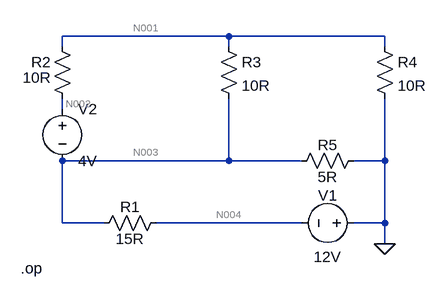
[diagram p0: schematic KSA_5.asc]
KSA_5.asc, the LTspice schematic file:
Version 4
SHEET 1 880 680
WIRE 288 -32 32 -32
WIRE 528 -32 288 -32
WIRE 32 -16 32 -32
WIRE 288 -16 288 -32
WIRE 528 -16 528 -32
WIRE 32 80 32 64
WIRE 288 160 288 64
WIRE 288 160 32 160
WIRE 400 160 288 160
WIRE 528 160 528 64
WIRE 528 160 480 160
WIRE 32 256 32 160
WIRE 96 256 32 256
WIRE 400 256 176 256
WIRE 528 256 528 160
WIRE 528 256 480 256
WIRE 528 288 528 256
FLAG 528 288 0
SYMBOL res 192 240 R90
WINDOW 0 7 56 VBottom 2
WINDOW 3 25 56 VTop 2
SYMATTR InstName R1
SYMATTR Value 15R
SYMBOL res 48 80 R180
WINDOW 0 33 72 Left 2
WINDOW 3 33 48 Left 2
SYMATTR InstName R2
SYMATTR Value 10R
SYMBOL res 272 -32 R0
SYMATTR InstName R3
SYMATTR Value 10R
SYMBOL res 512 -32 R0
SYMATTR InstName R4
SYMATTR Value 10R
SYMBOL res 384 176 R270
WINDOW 0 25 56 VTop 2
WINDOW 3 7 56 VBottom 2
SYMATTR InstName R5
SYMATTR Value 5R
SYMBOL voltage 496 256 R90
WINDOW 0 -27 56 VBottom 2
WINDOW 3 36 56 VTop 2
SYMATTR InstName V1
SYMATTR Value 12V
SYMBOL voltage 32 64 R0
SYMATTR InstName V2
SYMATTR Value 4V
TEXT -32 326 Left 2 !.op

The netlist it stands for:
* KSA_5.asc
R1 N004 N003 15R
R2 N002 N001 10R
R3 N001 N003 10R
R4 N001 0 10R
R5 N003 0 5R
V1 0 N004 12V
V2 N002 N003 4V
.op
.backanno
.end

* Results of the author's LTspice run, read from the files saved beside the schematic
* Operating Point:
*   V(n004) = -12 V
*   V(n003) = -2.8 V
*   V(n002) = 1.2 V
*   V(n001) = -533.3 mV
*   I(R1) = -613.3 mA
*   I(R2) = 173.3 mA
*   I(R3) = 226.7 mA
*   I(R4) = -53.33 mA
*   I(R5) = -560 mA
*   I(V1) = -613.3 mA
*   I(V2) = -173.3 mA